# EAGLE design HIRIMINI-BANTAM (EAGLE 9.6.2)
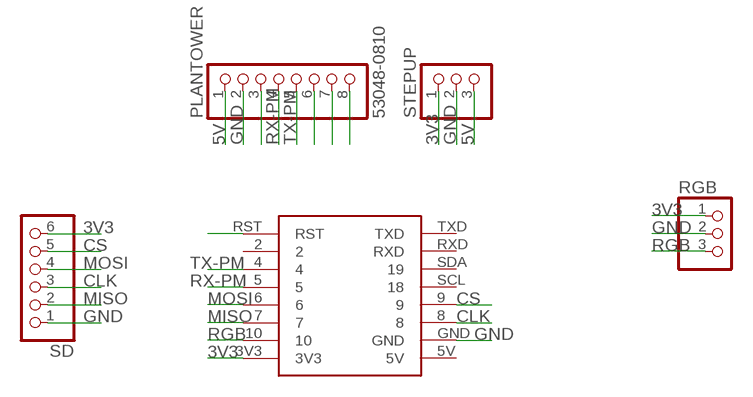
[diagram p0: schematic, sheet 1]

## Parts
PLANTOWER  53048-0810  [MOLEX_53048-0810]
RGB  PINHD-1X3  [1X03]
SD  PINHD-1X6  [1X06]
STEPUP  PINHD-1X3  [1X03]
U$2  LILYGOPLUSMINI  [LILYGO-PADS]

## Nets
3V3: RGB.1 SD.6 STEPUP.1 U$2.3V3
5V: PLANTOWER.1 STEPUP.3
CLK: SD.3 U$2.8
CS: SD.5 U$2.9
GND: PLANTOWER.2 RGB.2 SD.1 STEPUP.2 U$2.GND
MISO: SD.2 U$2.7
MOSI: SD.4 U$2.6
N$3: PLANTOWER.3
N$12: U$2.RST
N$19: PLANTOWER.6
N$20: PLANTOWER.7
N$21: PLANTOWER.8
RGB: RGB.3 U$2.10
RX-PM: PLANTOWER.4 U$2.5
TX-PM: PLANTOWER.5 U$2.4
Unconnected: U$2.2 U$2.5V U$2.RXD U$2.SCL U$2.SDA U$2.TXD

## Library data of the parts
PLANTOWER = ConectorPlantower:53048-0810: 1.25mm Pitch PicoBlade Header, Right Angle, 8 Circuits Check availability <https://pricing.snapeda.com/parts/53048-0810/Molex/view-part?ref=eda>; AVAILABILITY: In Stock; CHECK_PRICES: https://www.snapeda.com/parts/53048-0810/Molex/view-part/?ref=eda; DESCRIPTION: 8 way through board PCB 90deg header | Molex Incorporated 53048-0810; MF: Molex; MP: 53048-0810; PACKAGE: None; PRICE: None; PURCHASE-URL: https://www.snapeda.com/api/url_track_click_mouser/?unipart_id=53851&manufacturer=Molex&part_name=53048-0810&search_term=picoblade 1.25mm header rightangle 8way; SNAPEDA_LINK: https://www.snapeda.com/parts/53048-0810/Molex/view-part/?ref=snap
RGB STEPUP = pinhead:PINHD-1X3: PIN HEADER
SD = pinhead:PINHD-1X6: PIN HEADER
U$2 = LILYGOMINI:LILYGOPLUSMINI

## Board
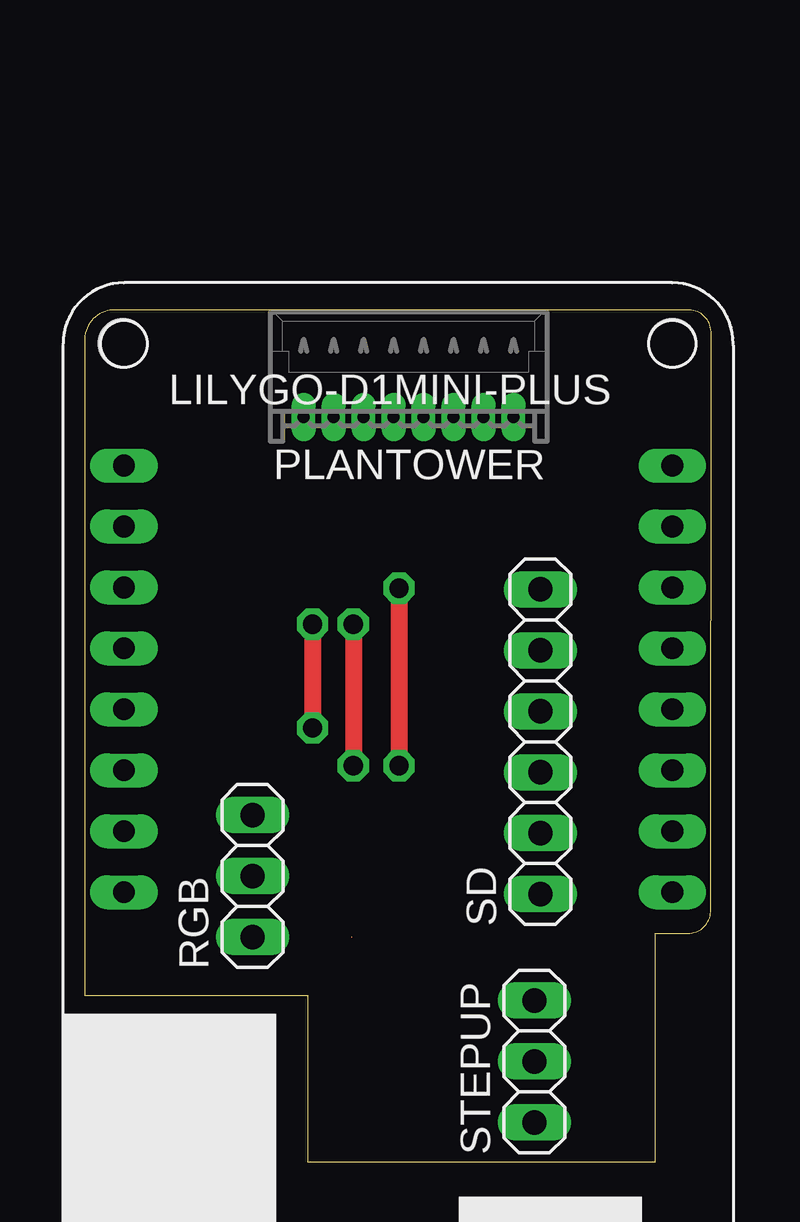
[diagram p1: board, top side]
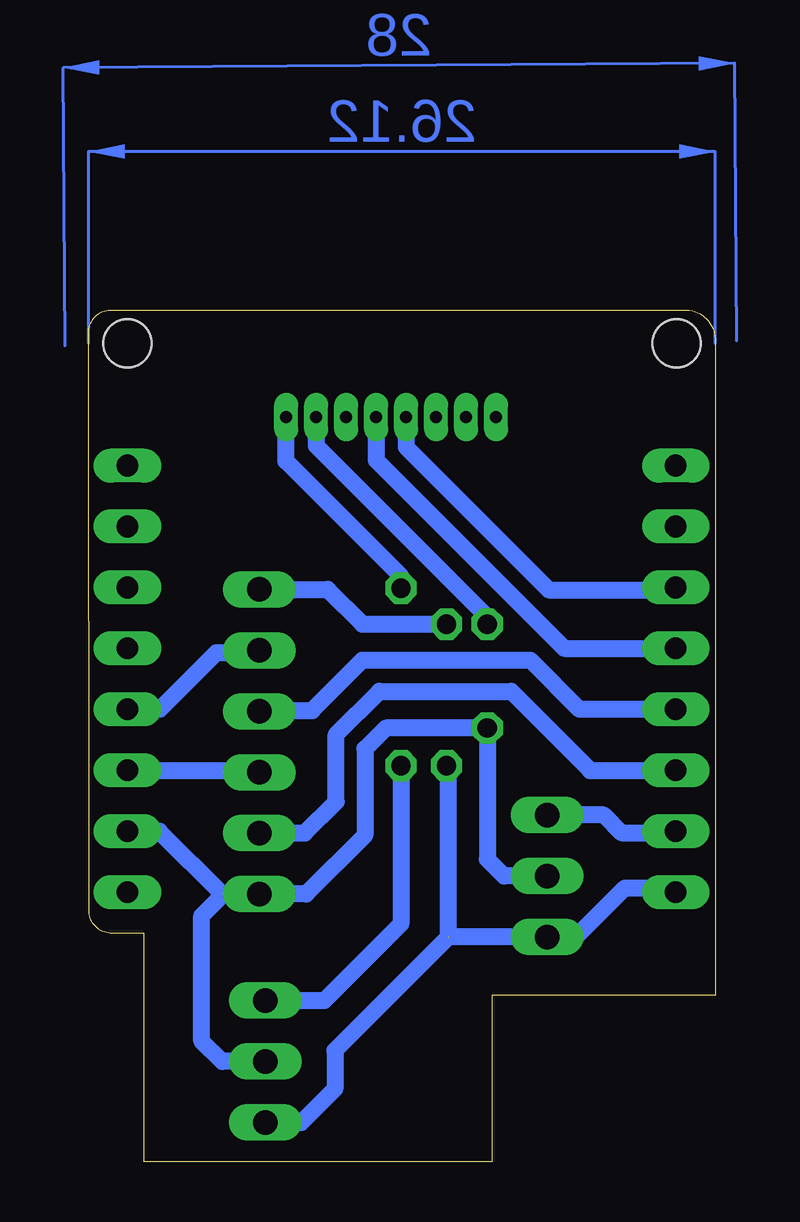
[diagram p2: board, bottom side, seen from below]

Size 26.12 x 35.5 mm. Coordinates in mm from the lower left corner, seen from the top.
Outline: 0,6.92 9.3,6.92 9.3,0 23.8,0 23.8,9.52 25.22,9.52 arc90 26.1,10.5 26.12,34.6 arc90 25.12,35.5 1.3,35.5 arc90 0,34.3 0,6.92
Copper layers (1*16): Top 0.035mm / dielectric 1.5mm / Bottom 0.035mm
Design rules "default *": minimum track width 0.7mm, minimum drill 0.35mm, track to track 0.4mm, track to pad 0.4mm, pad to pad 0.4mm, via to via 0.4mm, smd to smd 6mil, copper to edge 0.4mm, drill to drill 0.4mm, minimum pad ring 10mil, minimum via ring 8mil, stop-mask expansion 4mil, vias tented up to drill 0mil, thermal gap 10mil
Holes 2 mm at 1.6,34.1 24.5,34.1

### Footprints (pad centres in the part's own frame; a part is rotated, then mirrored left to right if it is on the bottom)
MOLEX_53048-0810 = drill 0.5 pad 0.762 long: 1 4.375,0.02; 2 3.125,0.02; 3 1.875,0.02; 4 0.625,0.02; 5 -0.625,0.02; 6 -1.875,0.02; 7 -3.125,0.02; 8 -4.375,0.02
1X03 = drill 1.016 long: 1 -2.54,0; 2 0,0; 3 2.54,0
1X06 = drill 1.016 long: 1 -6.35,0; 2 -3.81,0; 3 -1.27,0; 4 1.27,0; 5 3.81,0; 6 6.35,0
LILYGO-PADS = drill 0.9 pad 1.143 long: 2 -11.43,6.35; 3V3 -11.43,-8.89; 4 -11.43,3.81; 5 -11.43,1.27; 5V 11.43,-8.89; 6 -11.43,-1.27; 7 -11.43,-3.81; 8 11.43,-3.81; 9 11.43,-1.27; 10 -11.43,-6.35; GND 11.43,-6.35; RST -11.43,8.89; RXD 11.43,6.35; SCL 11.43,1.27; SDA 11.43,3.81; TXD 11.43,8.89

### Placement (x,y rotation side)
PLANTOWER  13.51,31.01 0 top
RGB  7,11.9 90 top
SD  19,17.5 90 top
STEPUP  18.75,4.17 90 top
U$2  13.07,20.12 0 top

### Tracks (layer width: path | path; a pad name or v marks a point on that pad's centre or on a via)
3V3  (via drill 0.8 pad 1.3)  (1 unrouted)
  Top 0.7: v11.2,22.4 v11.2,16.5
  Bottom 0.7: STEPUP.1 17.25,1.63 15.85,3.03 15.85,4.63 11.13,9.35 11.13,16.43 v11.2,16.5 | U$2.3V3 1.7,11.4 3.76,11.4 5.8,9.36 RGB.1 11.12,9.36 | SD.6 16.15,23.85 14.7,22.4 v11.2,22.4
5V  (via drill 0.8 pad 1.3)
  Top 0.7: v13.1,23.9 v13.1,16.5
  Bottom 0.7: STEPUP.3 16.29,6.71 13.1,9.9 v13.1,16.5 | v13.1,23.9 13.1,24.4 17.89,29.19 PLANTOWER.1 | PLANTOWER.1 | PLANTOWER.1
CLK
  Bottom 0.7: U$2.8 19.08,16.31 SD.3
CS
  Bottom 0.7: U$2.9 23.15,18.85 20.79,21.21 19.1,21.21 SD.5
GND  (via drill 0.8 pad 1.3)
  Top 0.7: v9.5,22.4 v9.5,18.07
  Bottom 0.7: U$2.GND 23.17,13.77 20.55,11.15 SD.1 | STEPUP.2 20.55,4.17 21.4,5.02 21.4,10.25 20.5,11.15 SD.1 | v9.5,22.4 9.5,22.7 16.63,29.84 PLANTOWER.2 | RGB.2 8.8,11.9 9.5,12.6 v9.5,18.07 13.73,18.07 14.6,17.2 14.6,13.6 17.05,11.15 SD.1
MISO
  Bottom 0.7: U$2.7 5.2,16.3 8.5,19.6 14,19.6 15.8,17.8 15.8,15 17.11,13.69 SD.2
MOSI
  Bottom 0.7: U$2.6 5.65,18.85 7.7,20.9 14.7,20.9 16.8,18.8 18.98,18.8 SD.4
RGB
  Bottom 0.7: U$2.10 1.71,13.7 3.9,13.7 4.64,14.44 RGB.3
RX-PM
  Bottom 0.7: PLANTOWER.4 14.13,29.23 6.29,21.39 U$2.5
TX-PM
  Bottom 0.7: PLANTOWER.5 12.88,29.78 6.93,23.83 1.74,23.83 U$2.4
(copper drawn outside any net)
  shapes: Bottom area x2